# EAGLE design project_schematic (EAGLE 9.6.2)
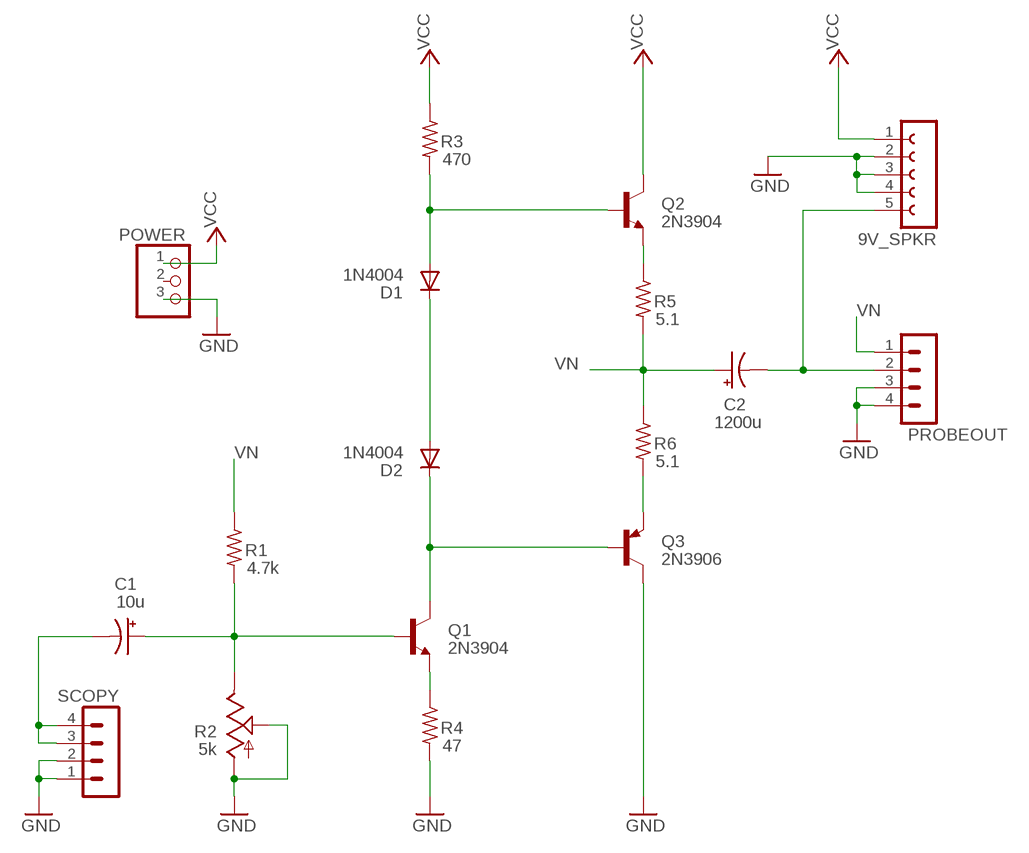
[diagram p0: schematic, sheet 1]

## Parts
9V_SPKR  FE05-1  [FE05-1]
C1  10u  CPOL-USE5-8.5  [E5-8,5]
C2  1200u  CPOL-USE5-10.5  [E5-10,5]
D1  1N4004  [DO41-10]
D2  1N4004  [DO41-10]
POWER  PINHD-1X3  [1X03]
PROBEOUT  MA04-1  [MA04-1]
Q1  2N3904  [TO92]
Q2  2N3904  [TO92]
Q3  2N3906  [TO92]
R1  4.7k  R-US_0204/7  [0204/7]
R2  5k  TRIM_US-CA6V  [CA6V]
R3  470  R-US_0204/7  [0204/7]
R4  47  R-US_0204/7  [0204/7]
R5  5.1  R-US_0204/7  [0204/7]
R6  5.1  R-US_0204/7  [0204/7]
SCOPY  MA04-1  [MA04-1]

## Nets
GND: 9V_SPKR.2 9V_SPKR.3 9V_SPKR.4 POWER.3 PROBEOUT.3 PROBEOUT.4 SCOPY.1 SCOPY.2
N$1: C1.+ Q1.2(B) R1.2 R2.E
N$2: Q1.3(E) R4.1
N$3: D2.C Q1.1(C) Q3.2(B)
N$5: D1.A Q2.2(B) R3.2
N$7: Q2.1(C) ; supply symbol labelled VCC
N$8: D1.C D2.A
N$9: Q2.3(E) R5.1
N$10: Q3.3(E) R6.2
N$11: 9V_SPKR.5 C2.- PROBEOUT.2
N$12: R2.A R2.S ; supply symbol labelled GND
N$13: R4.2 ; supply symbol labelled GND
N$14: Q3.1(C) ; supply symbol labelled GND
N$17: C1.- SCOPY.3 SCOPY.4
N$18: 9V_SPKR.1 ; supply symbol labelled VCC
VCC: POWER.1 R3.1
VN: C2.+ PROBEOUT.1 R1.1 R5.2 R6.1
Unconnected: POWER.2

## Library data of the parts
9V_SPKR = con-lsta:FE05-1: FEMALE HEADER; OC_FARNELL: unknown; OC_NEWARK: unknown
C1 C2 = adafruit:CPOL-US: POLARIZED CAPACITOR, American symbol
D1 D2 = adafruit:1N4004: DIODE General purpose 1N400x type rectifier (With bigger pads) http://www.ladyada.net/library/pcb/eaglelibrary.html
POWER = adafruit:PINHD-1X3: PIN HEADER
PROBEOUT SCOPY = con-lstb:MA04-1: PIN HEADER; OC_FARNELL: unknown; OC_NEWARK: unknown
Q1 Q2 = transistor:2N3904: NPN TRANSISTOR
Q3 = transistor-pnp:2N3906: PNP Transistor
R1 R3-R6 = rcl:R-US_: RESISTOR, American symbol; SPICEPREFIX: R
R2 = pot:TRIM_US-: POTENTIOMETER

## Board
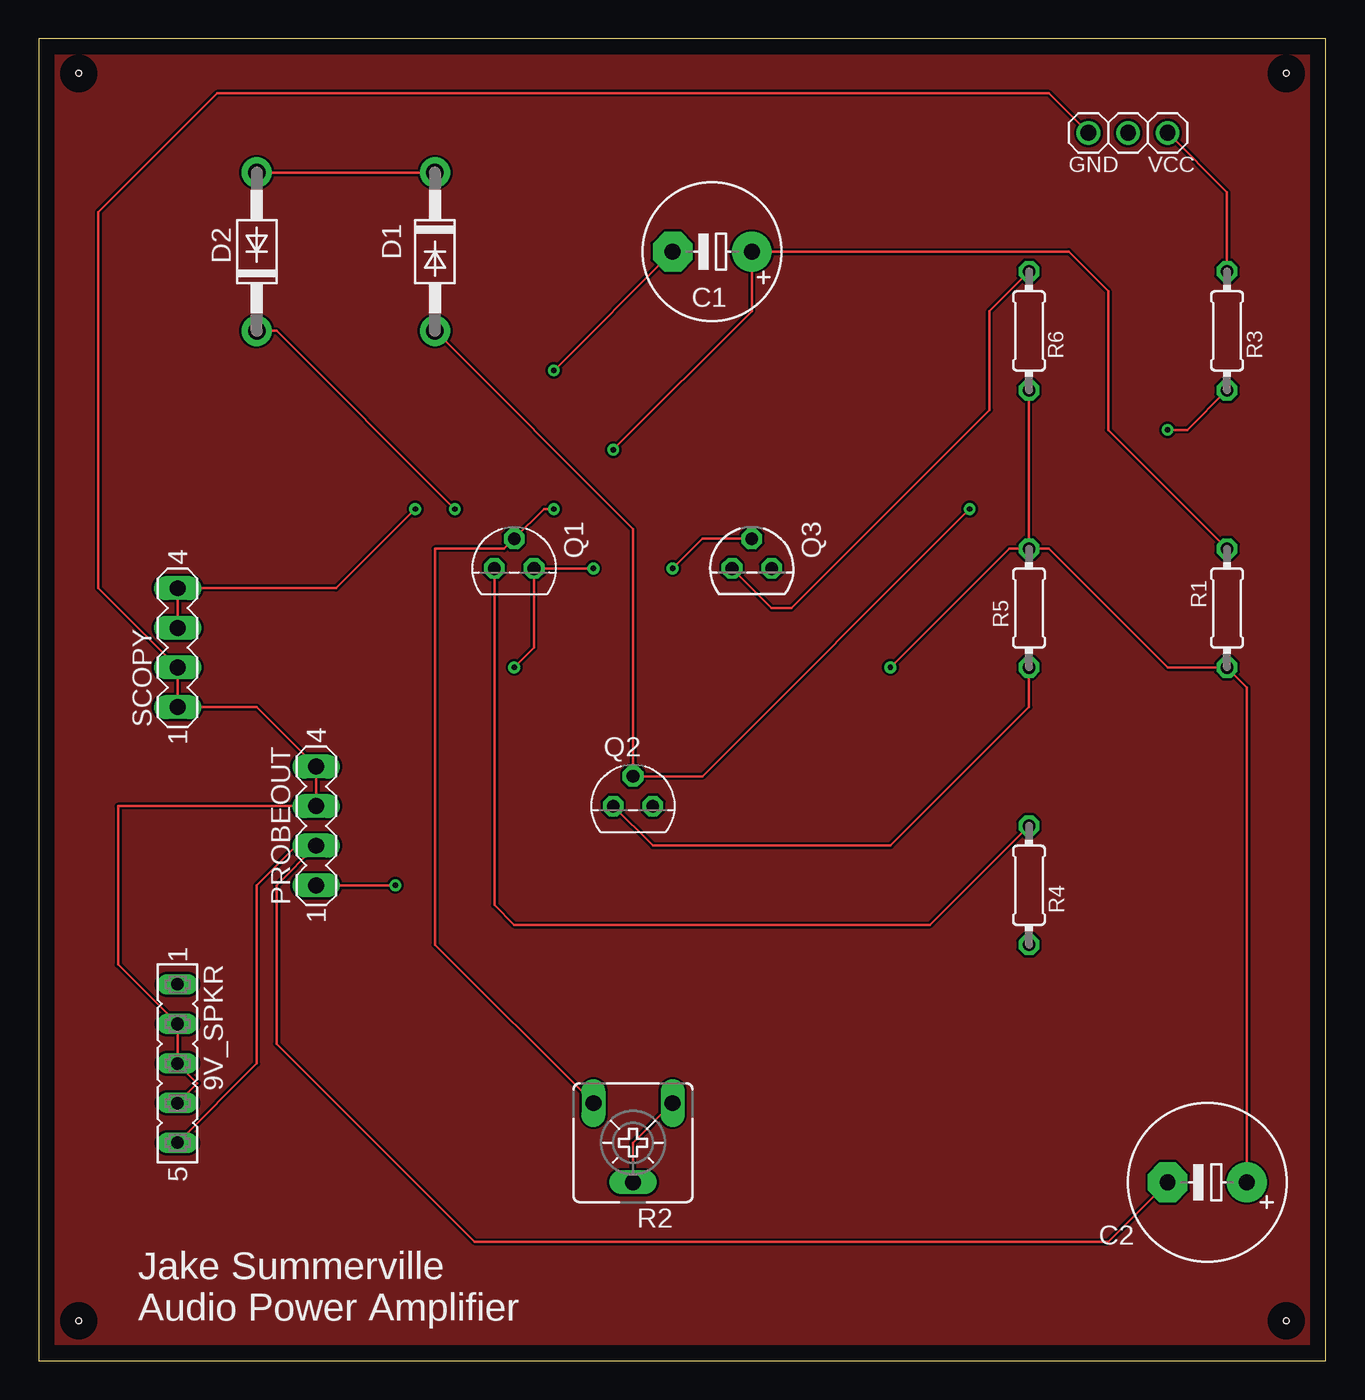
[diagram p1: board, top side]
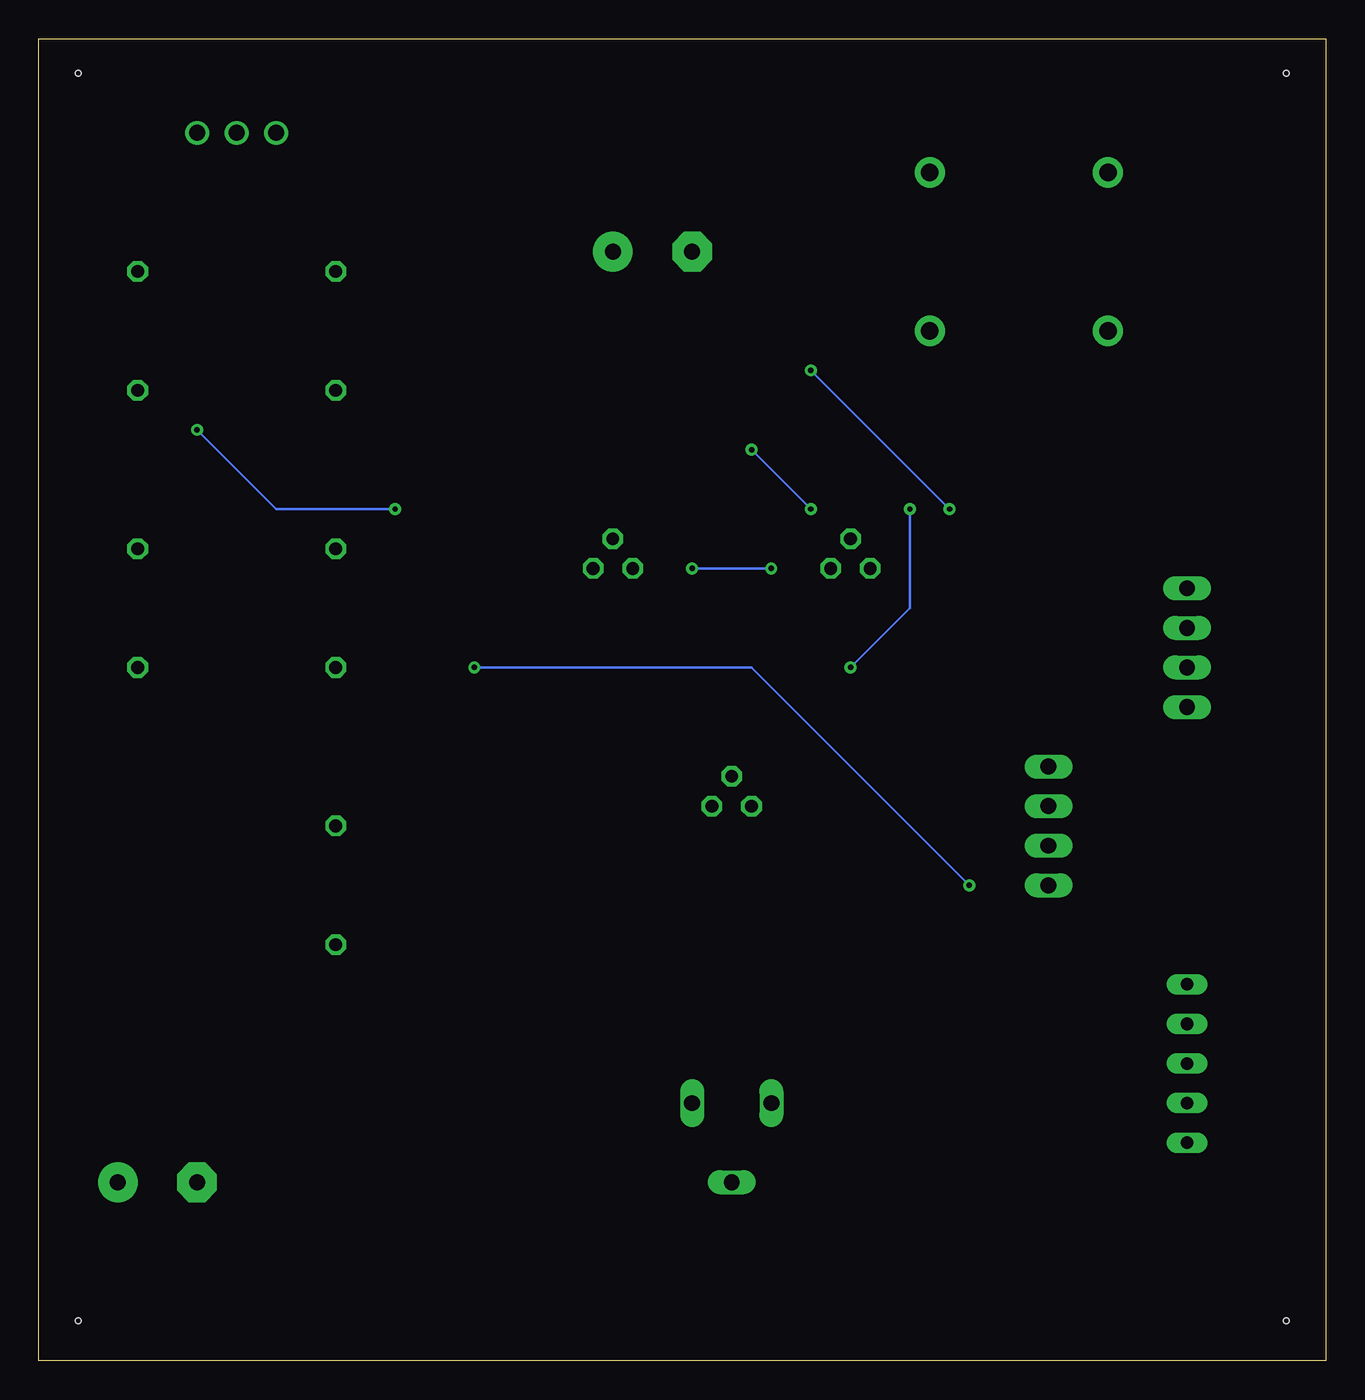
[diagram p2: board, bottom side, seen from below]

Size 82.53 x 84.76 mm. Coordinates in mm from the lower left corner, seen from the top.
Outline: 0,0 82.53,0 82.53,84.76 0,84.76 0,0
Copper layers (1*16): Top 0.035mm / dielectric 1.5mm / Bottom 0.035mm
Design rules "default": minimum track width 6mil, minimum drill 0.35mm, track to track 6mil, track to pad 6mil, pad to pad 6mil, via to via 6mil, smd to smd 6mil, copper to edge 40mil, drill to drill 6mil, minimum pad ring 10mil, minimum via ring 8mil, stop-mask expansion 4mil, vias tented up to drill 0mil, thermal gap 10mil
Holes 0.35 mm at 2.54,82.55 80.01,82.55 80.01,2.54 2.54,2.54

### Footprints (pad centres in the part's own frame; a part is rotated, then mirrored left to right if it is on the bottom)
FE05-1 = drill 0.813 long: 1 -5.08,0; 2 -2.54,0; 3 0,0; 4 2.54,0; 5 5.08,0
E5-8,5 = drill 1.016 pad 2.54: + -2.54,0 | drill 1.016 pad 2.54 octagon: - 2.54,0
E5-10,5 = drill 1.016 pad 2.54: + -2.54,0 | drill 1.016 pad 2.54 octagon: - 2.54,0
DO41-10 = drill 1.118 pad 1.93: A 5.08,0; C -5.08,0
1X03 = drill 1.016: 1 -2.54,0; 2 0,0; 3 2.54,0
MA04-1 = drill 1.016 long: 1 -3.81,0; 2 -1.27,0; 3 1.27,0; 4 3.81,0
TO92 = drill 0.813 octagon: 1 1.27,0; 2 0,1.905; 3 -1.27,0
0204/7 = drill 0.813 octagon: 1 -3.81,0; 2 3.81,0
CA6V = drill 1.016 long: A -2.54,-2.54; E 2.54,-2.54; S 0,2.54

### Placement (x,y rotation side)
9V_SPKR  8.89,19.05 270 top
C1  43.18,71.12 180 top
C2  74.93,11.43 180 top
D1  25.4,71.12 270 top
D2  13.97,71.12 90 top
POWER  69.85,78.74 180 top
PROBEOUT  17.78,34.29 90 top
Q1  30.48,50.8 0 top
Q2  38.1,35.56 0 top
Q3  45.72,50.8 0 top
R1  76.2,48.26 90 top
R2  38.1,13.97 180 top
R3  76.2,66.04 270 top
R4  63.5,30.48 270 top
R5  63.5,48.26 90 top
R6  63.5,66.04 90 top
SCOPY  8.89,45.72 90 top

### Tracks (layer width: path | path; a pad name or v marks a point on that pad's centre or on a via)
GND
  Top 0.152: 9V_SPKR.4 10.16,17.78 9V_SPKR.3 9V_SPKR.2 5.08,25.4 5.08,35.56 PROBEOUT.3 PROBEOUT.4 13.97,41.91 SCOPY.1 SCOPY.2 3.81,49.53 3.81,73.66 11.43,81.28 64.77,81.28 POWER.3
N$1  (via drill 0.35)
  Top 0.152: v33.02,54.61 32.38,54.61 Q1.2 29.84,52.07 25.4,52.07 25.4,26.67 R2.E | v36.83,58.42 45.72,67.31 C1.+ 66.04,71.12 68.58,68.58 68.58,59.69 R1.2
  Bottom 0.152: v33.02,54.61 v36.83,58.42
N$2
  Top 0.152: Q1.3 29.21,29.21 30.48,27.94 57.15,27.94 R4.1
N$3  (via drill 0.35)
  Top 0.152: v35.56,50.8 Q1.1 31.75,45.72 v30.48,44.45 | v40.64,50.8 42.55,52.7 Q3.2 | D2.C 15.24,66.04 v26.67,54.61
  Bottom 0.152: v35.56,50.8 v40.64,50.8 | v26.67,54.61 26.67,48.26 v30.48,44.45
N$4
  pour Top: 0,84.76 0,0 82.53,0 82.53,84.76
N$5  (via drill 0.35)
  Top 0.152: D1.A 38.1,53.34 Q2.2 42.55,37.47 v59.69,54.61 | R3.2 73.66,59.69 v72.39,59.69
  Bottom 0.152: v72.39,59.69 67.31,54.61 v59.69,54.61
N$8
  Top 0.152: D2.A D1.C
N$9
  Top 0.152: Q2.3 39.37,33.02 54.61,33.02 63.5,41.91 R5.1
N$10
  Top 0.152: Q3.3 46.99,48.26 48.26,48.26 60.96,60.96 60.96,67.31 R6.2
N$11
  Top 0.152: 9V_SPKR.5 13.97,19.05 13.97,30.48 16.51,33.02 PROBEOUT.2 15.24,30.48 15.24,20.32 27.94,7.62 68.58,7.62 C2.-
N$12
  Top 0.152: R2.S 38.1,13.97 R2.A
N$17  (via drill 0.35)
  Top 0.152: SCOPY.3 SCOPY.4 19.05,49.53 v24.13,54.61 | C1.- v33.02,63.5
  Bottom 0.152: v33.02,63.5 v24.13,54.61
VCC
  Top 0.152: POWER.1 76.2,74.93 R3.1
VN  (via drill 0.35)
  Top 0.152: R5.2 R6.1 | R5.2 64.77,52.07 72.39,44.45 R1.1 77.47,43.18 C2.+ | PROBEOUT.1 v22.86,30.48 | v54.61,44.45 62.23,52.07 R5.2
  Bottom 0.152: v22.86,30.48 36.83,44.45 v54.61,44.45

### Text on the board
tPlace: GND | VCC | Jake Summerville / Audio Power Amplifier